# EAGLE board citizen_science_flora_v2_DFA_corrected (EAGLE 9.6.2)
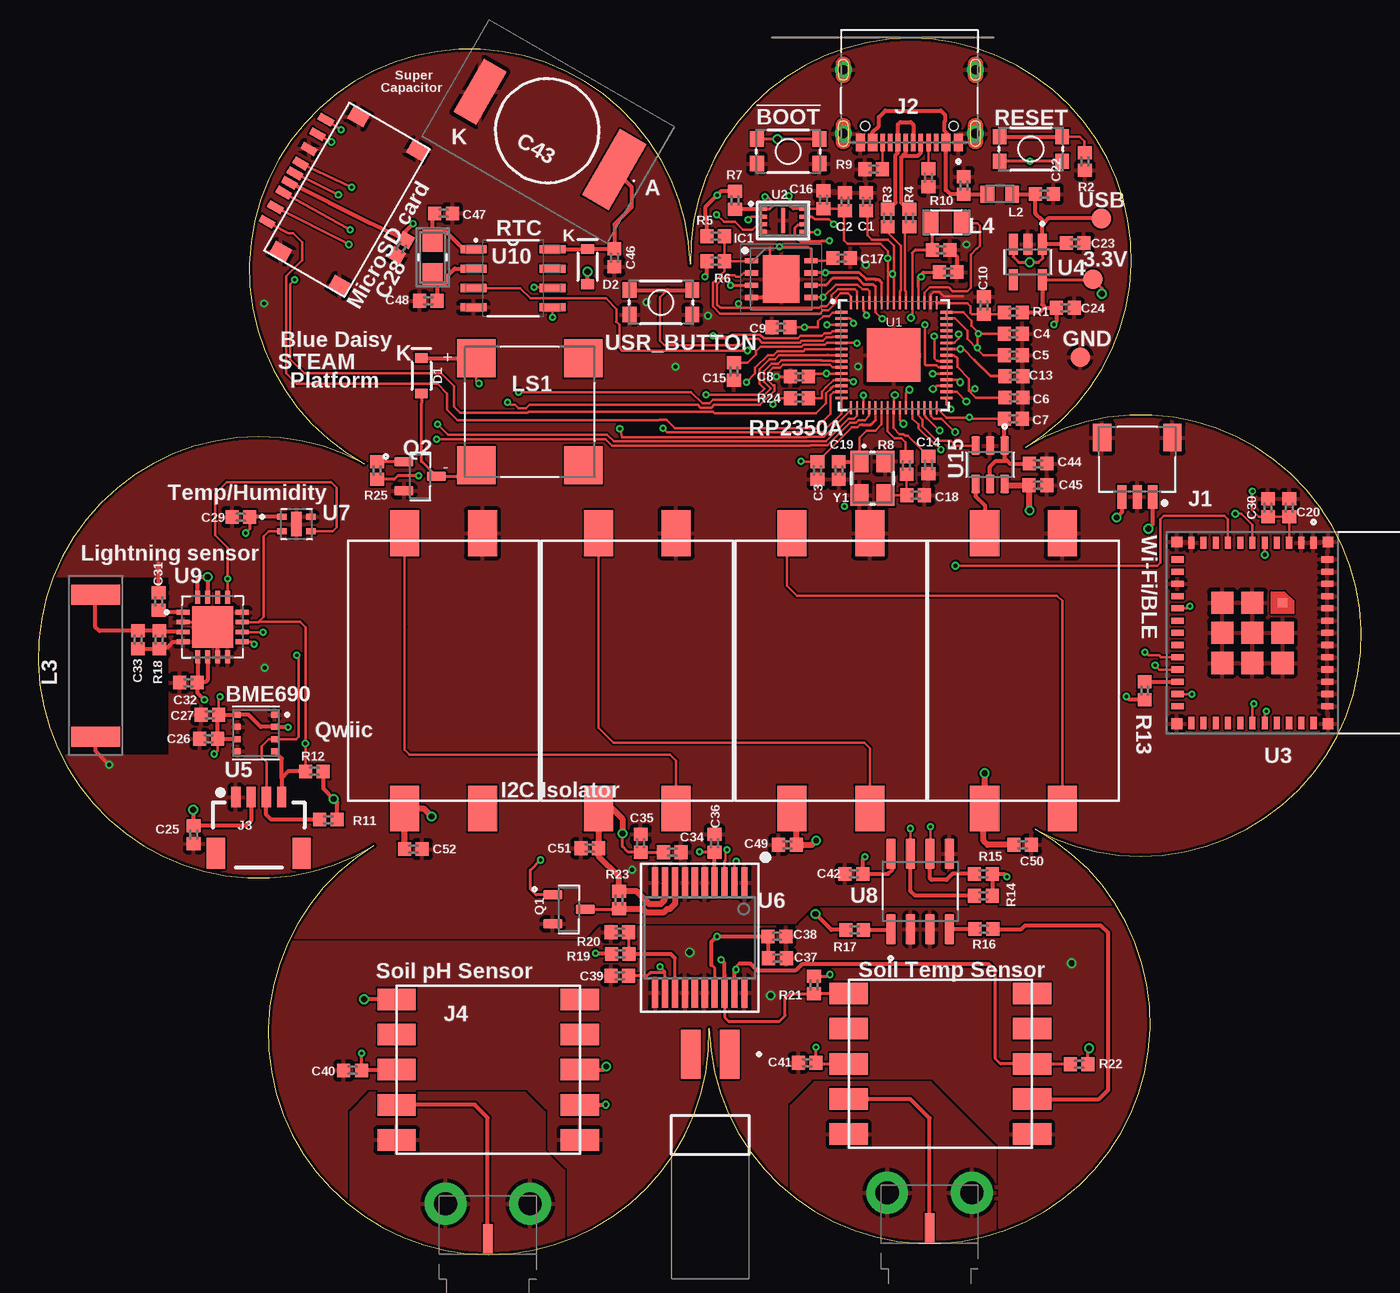
[diagram p4: board, top side]
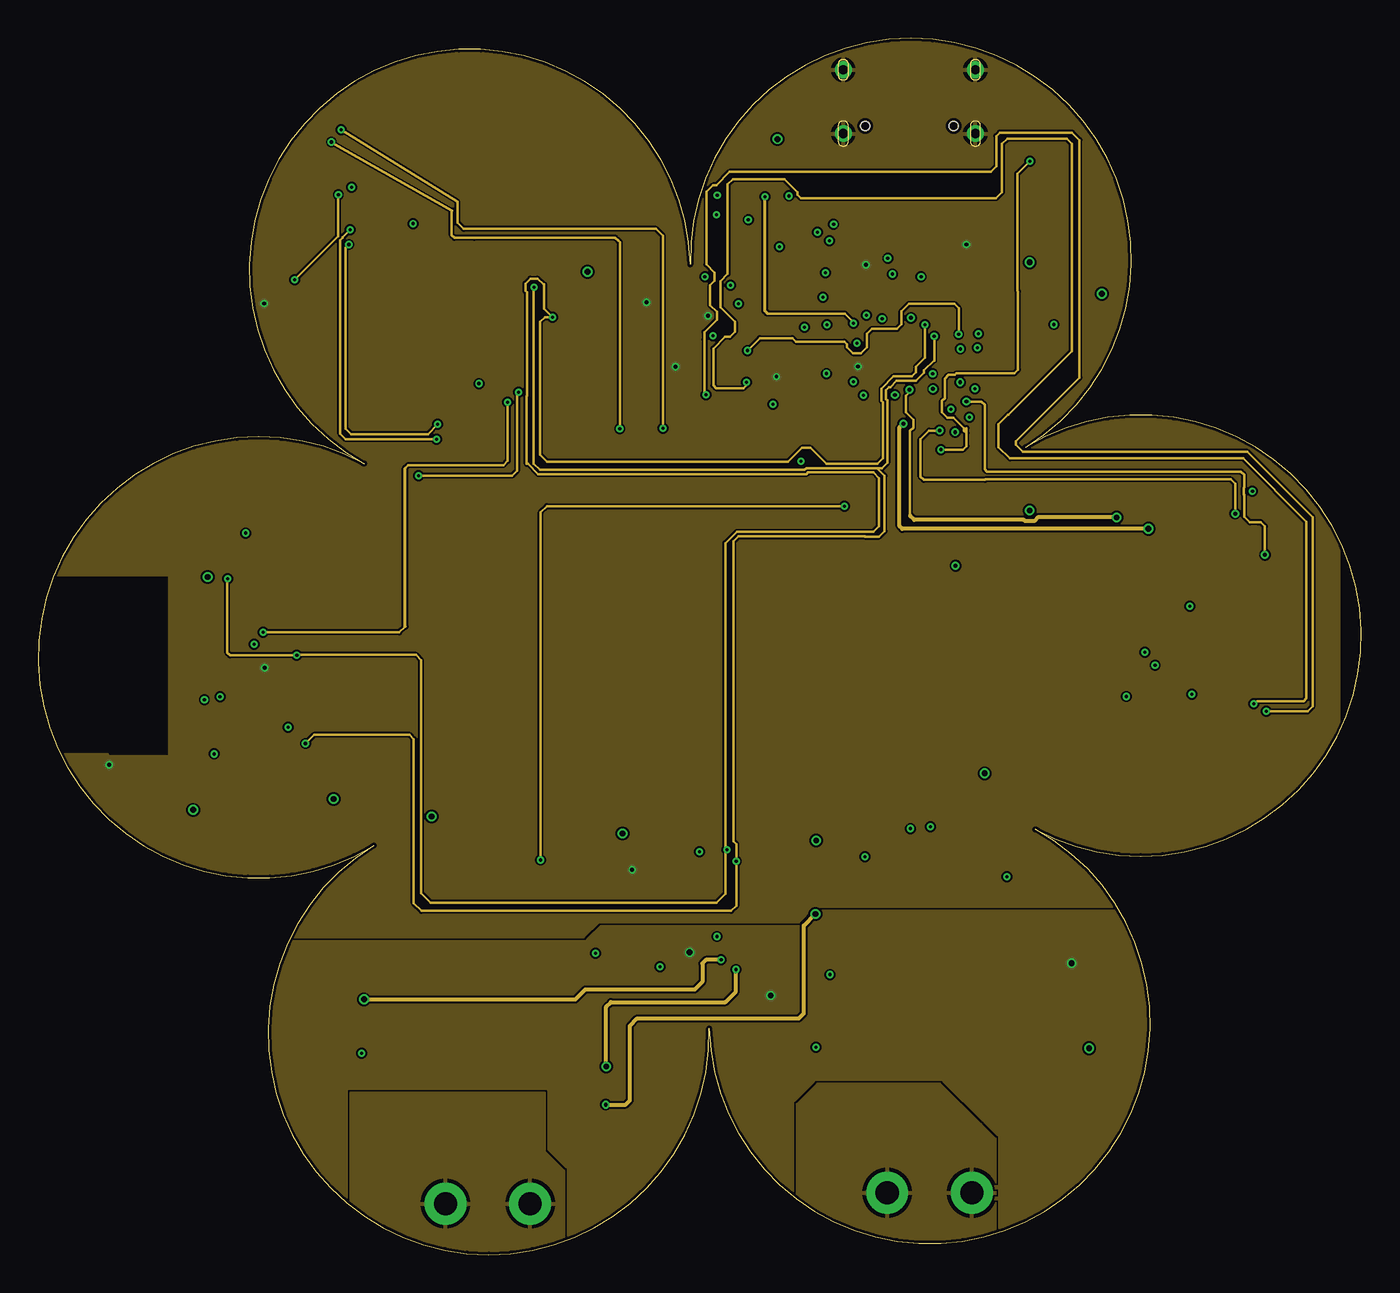
[diagram p5: board, inner layer Route2]
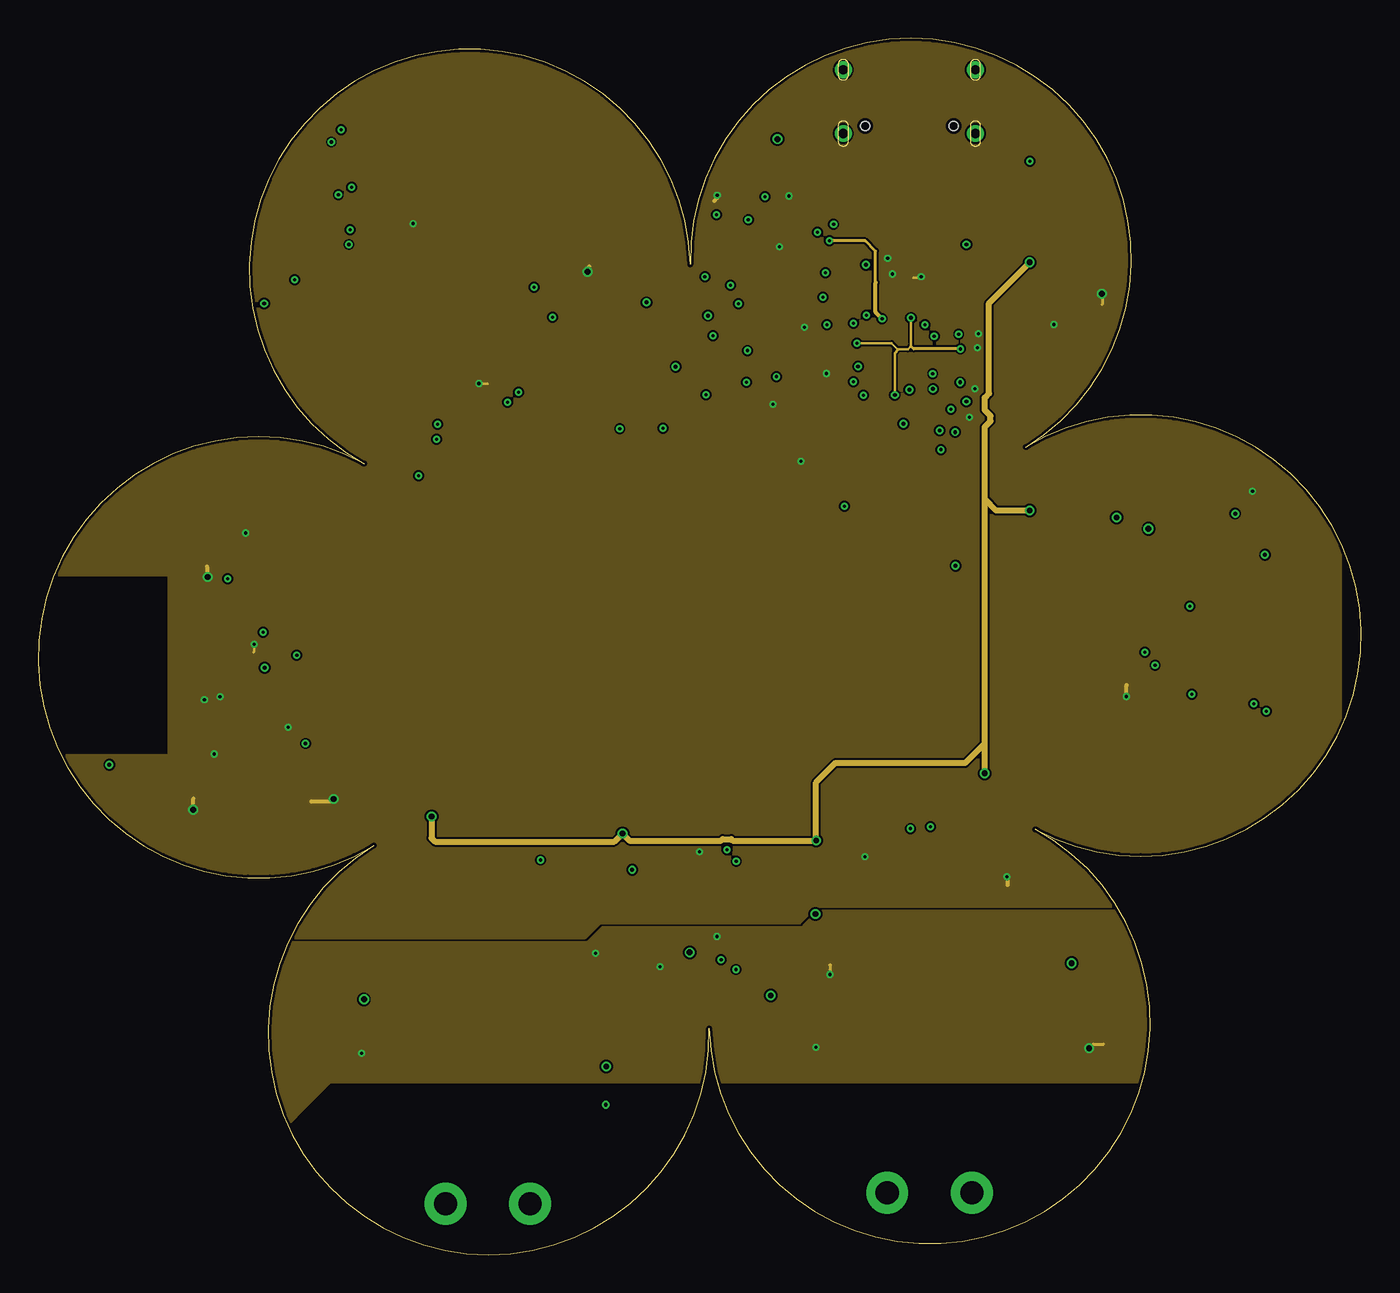
[diagram p6: board, inner layer Route15]
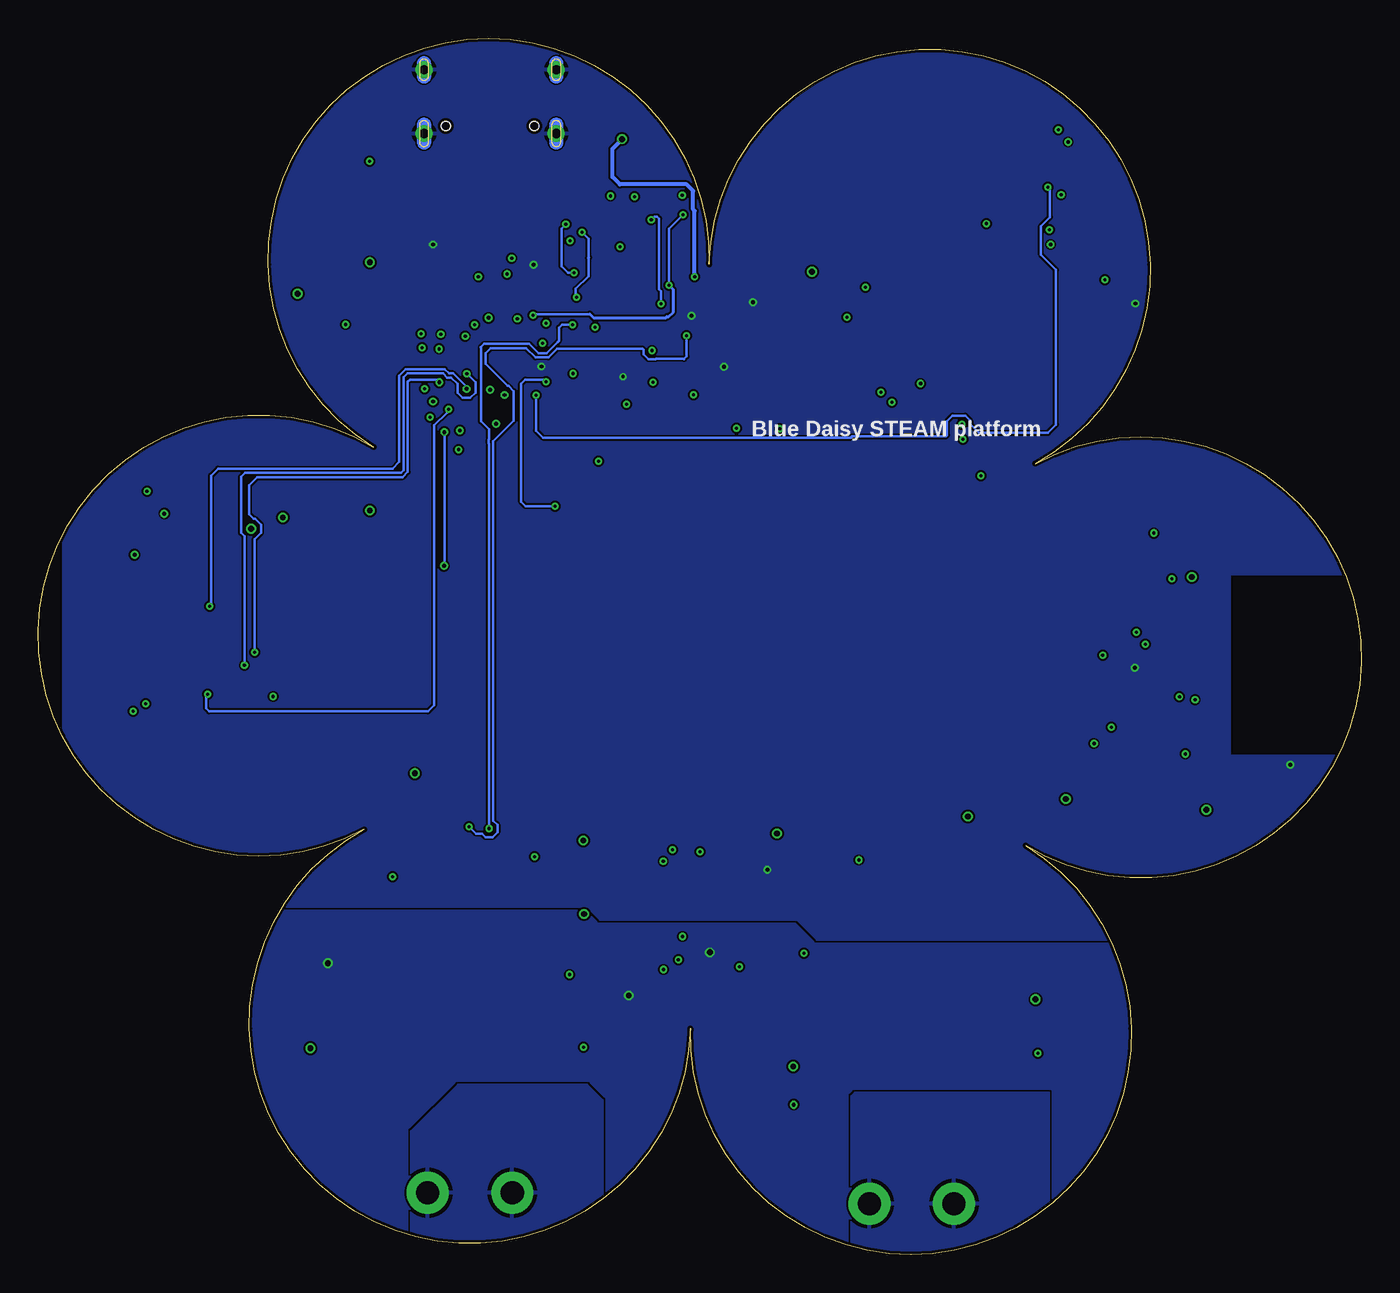
[diagram p7: board, bottom side, seen from below]

Size 86.58 x 79.57 mm. Coordinates in mm from the lower left corner, seen from the top.
Outline: 42.67,64.78 arc240 21.34,51.74 arc240 21.95,26.75 arc240 43.91,14.79 arc240 65.24,27.82 arc240 64.62,52.82 arc240 42.67,64.78
Copper layers (1+2*15+16): Top 0.035mm / dielectric 0.2mm / Route2 0.0175mm / dielectric 1.065mm / Route15 0.0175mm / dielectric 0.2mm / Bottom 0.035mm
Design rules "jlcpcb-4layers": minimum track width 3.5mil, minimum drill 0.2mm, track to track 5mil, track to pad 0.2mm, pad to pad 5mil, via to via 0.5mm, smd to smd 5mil, copper to edge 0.2mm, drill to drill 6mil, minimum pad ring 10mil, minimum via ring 0.13mm, stop-mask expansion 0.05mm, vias tented up to drill 16mil, thermal gap 10mil

## Footprints (pad centres in the part's own frame; a part is rotated, then mirrored left to right if it is on the bottom)
B1,27 = smd 1.27 x 1.27: TP 0,0
TACTILE_SWITCH_SMD_4.6X2.8MM = smd 0.9 x 1: 1 -2.05,-0.8; 2 2.05,-0.8; 3 2.05,0.8; 4 -2.05,0.8
0402 = smd 0.85 x 0.9: 1 -0.58,0; 2 0.58,0
RSCSK2043R3D01004T = smd 5 x 2: 1 0,5.075 | smd 4 x 1.7: 2 0,-5.075
SOD-323 = smd 0.63 x 0.83: A 1.15,0; C -1.15,0
SON80P400X400X50-9N = smd 0.85 x 0.35: 1 -1.95,1.2; 2 -1.95,0.4; 3 -1.95,-0.4; 4 -1.95,-1.2; 5 1.95,-1.2; 6 1.95,-0.4; 7 1.95,0.4; 8 1.95,1.2 | smd 2.4 x 3.1: 9 0,0
JST_SM03B-SRSS-TB(LF)(SN) = smd 0.6 x 1.55: 1 -1,0; 2 0,0; 3 1,0 | smd 1.2 x 1.8: S1 -2.3,-3.875; S2 2.3,-3.875
HRO_TYPE-C-31-M-12 = smd 0.6 x 1.14: A1_B12 -3.2,4.75; A4_B9 -2.4,4.75; B1_A12 3.2,4.75; B4_A9 2.4,4.75 | smd 0.3 x 1.14: A5 -1.25,4.75; A6 -0.25,4.75; A7 0.25,4.75; A8 1.25,4.75; B5 1.75,4.75; B6 0.75,4.75; B7 -0.75,4.75; B8 -1.75,4.75 | drill 0.6 pad 0.9: S1 -4.325,4.17; S2 4.325,4.17; S3 -4.325,0; S4 4.325,0 | hole 0.6: -2.89,3.68; 2.89,3.68
1X04_1MM_RA = smd 0.6 x 1.35: 1 -1.5,0; 2 -0.5,0; 3 0.5,0; 4 1.5,0 | smd 1.2 x 2: NC1 2.8,-3.675; NC2 -2.8,-3.675
60312202114511 = smd 0.61 x 1.97: 1 0,-2.325 | drill 1.52: 2 -2.77,0; 3 2.77,0
SAMTEC_TSM-102-02-S-SH = smd 1.27 x 3.18: 01 -1.27,-5.28; 02 1.27,-5.28
INDC1608X100N = smd 0.89 x 1.11: 1 -0.814,0; 2 0.814,0
MA5532-AE = smd 1.3 x 3.2: 1 -4.65,0; 2 4.65,0
IND_LQH2MCN120K02L = smd 1 x 1.6: 1 -1,0; 2 1,0
XDCR_CMT-8504-100-SMT-TR = smd 2.5 x 2.5: 1 3.5,3.5; 2 3.5,-3.5; N -3.5,-3.5; P -3.5,3.5
SOT95P240X111-3N = smd 1.23 x 0.6: 1 -1.06,0.95; 2 -1.06,-0.95; 3 1.06,0
RP2350A = smd 0.875 x 0.2: 1 -3.437,2.8; 2 -3.437,2.4; 3 -3.437,2; 4 -3.437,1.6; 5 -3.437,1.2; 6 -3.437,0.8; 7 -3.437,0.4; 8 -3.437,0; 9 -3.437,-0.4; 10 -3.437,-0.8; 11 -3.437,-1.2; 12 -3.437,-1.6; 13 -3.437,-2; 14 -3.437,-2.4; 15 -3.437,-2.8; 31 3.437,-2.8; 32 3.437,-2.4; 33 3.437,-2; 34 3.437,-1.6; 35 3.437,-1.2; 36 3.437,-0.8; 37 3.437,-0.4; 38 3.437,0; 39 3.437,0.4; 40 3.437,0.8; 41 3.437,1.2; 42 3.437,1.6; 43 3.437,2; 44 3.437,2.4; 45 3.437,2.8 | smd 0.2 x 0.875: 16 -2.8,-3.437; 17 -2.4,-3.437; 18 -2,-3.437; 19 -1.6,-3.437; 20 -1.2,-3.437; 21 -0.8,-3.437; 22 -0.4,-3.437; 23 0,-3.437; 24 0.4,-3.437; 25 0.8,-3.437; 26 1.2,-3.437; 27 1.6,-3.437; 28 2,-3.437; 29 2.4,-3.437; 30 2.8,-3.437; 46 2.8,3.437; 47 2.4,3.437; 48 2,3.437; 49 1.6,3.437; 50 1.2,3.437; 51 0.8,3.437; 52 0.4,3.437; 53 0,3.437; 54 -0.4,3.437; 55 -0.8,3.437; 56 -1.2,3.437; 57 -1.6,3.437; 58 -2,3.437; 59 -2.4,3.437; 60 -2.8,3.437 | smd 3.5 x 3.5: EPAD 0,0
APS6404L-3SQR-ZR = smd 0.4 x 0.25: 1 -1.25,0.75; 2 -1.25,0.25; 3 -1.25,-0.25; 4 -1.25,-0.75; 5 1.25,-0.75; 6 1.25,-0.25; 7 1.25,0.25; 8 1.25,0.75 | smd 0.2 x 1.6: 9 0,0
XCVR_ESP32-C3-MINI-1-N4 = smd 0.8 x 0.4: 1 -5.9,1.3; 2 -5.9,0.5; 3 -5.9,-0.3; 4 -5.9,-1.1; 5 -5.9,-1.9; 6 -5.9,-2.7; 7 -5.9,-3.5; 8 -5.9,-4.3; 9 -5.9,-5.1; 10 -5.9,-5.9; 11 -5.9,-6.7; 25 5.9,-6.7; 26 5.9,-5.9; 27 5.9,-5.1; 28 5.9,-4.3; 29 5.9,-3.5; 30 5.9,-2.7; 31 5.9,-1.9; 32 5.9,-1.1; 33 5.9,-0.3; 34 5.9,0.5; 35 5.9,1.3 | smd 0.4 x 0.8: 12 -4.8,-7.6; 13 -4,-7.6; 14 -3.2,-7.6; 15 -2.4,-7.6; 16 -1.6,-7.6; 17 -0.8,-7.6; 18 0,-7.6; 19 0.8,-7.6; 20 1.6,-7.6; 21 2.4,-7.6; 22 3.2,-7.6; 23 4,-7.6; 24 4.8,-7.6; 36 4.8,2.2; 37 4,2.2; 38 3.2,2.2; 39 2.4,2.2; 40 1.6,2.2; 41 0.8,2.2; 42 0,2.2; 43 -0.8,2.2; 44 -1.6,2.2; 45 -2.4,2.2; 46 -3.2,2.2; 47 -4,2.2; 48 -4.8,2.2 | smd 0.6 x 0.6: 49_1 -1.975,-0.725 | smd 1.45 x 1.45: 49_2 0,-0.725; 49_3 1.975,-0.725; 49_4 1.975,-2.7; 49_5 1.975,-4.675; 49_6 0,-4.675; 49_7 -1.975,-4.675; 49_8 -1.975,-2.7; 49_9 0,-2.7 | smd 0.7 x 0.7: 50 5.95,2.25; 51 5.95,-7.65; 52 -5.95,-7.65; 53 -5.95,2.25
SOT95P280X145-5N = smd 1.39 x 0.58: 1 -1.165,0.95; 2 -1.165,0; 3 -1.165,-0.95; 4 1.165,-0.95; 5 1.165,0.95
IC_BME688 = smd 0.4 x 0.4: 1 1.2,1.2; 2 1.2,0.4; 3 1.2,-0.4; 4 1.2,-1.2; 5 -1.2,-1.2; 6 -1.2,-0.4; 7 -1.2,0.4; 8 -1.2,1.2
SSOP20 = smd 0.4 x 2: P1 -2.925,-3.6; P2 -2.275,-3.6; P3 -1.625,-3.6; P4 -0.975,-3.6; P5 -0.325,-3.6; P6 0.325,-3.6; P7 0.975,-3.6; P8 1.625,-3.6; P9 2.275,-3.6; P10 2.925,-3.6; P11 2.925,3.6; P12 2.275,3.6; P13 1.625,3.6; P14 0.975,3.6; P15 0.325,3.6; P16 -0.325,3.6; P17 -0.975,3.6; P18 -1.625,3.6; P19 -2.275,3.6; P20 -2.925,3.6
XDCR_ENS210-LQFM = smd 0.6 x 0.4: 1 -0.95,0.475; 2 -0.95,-0.475; 3 0.95,-0.475; 4 0.95,0.475 | smd 0.7 x 1.6: 5 0,0
SOIC127P599X175-8N = smd 1.97 x 0.6: 1 -2.47,1.905; 2 -2.47,0.635; 3 -2.47,-0.635; 4 -2.47,-1.905; 5 2.47,-1.905; 6 2.47,-0.635; 7 2.47,0.635; 8 2.47,1.905
QFN65P400X400X80-17N = smd 0.84 x 0.32: 1 -1.935,0.975; 2 -1.935,0.325; 3 -1.935,-0.325; 4 -1.935,-0.975; 9 1.935,-0.975; 10 1.935,-0.325; 11 1.935,0.325; 12 1.935,0.975 | smd 0.32 x 0.84: 5 -0.975,-1.935; 6 -0.325,-1.935; 7 0.325,-1.935; 8 0.975,-1.935; 13 0.975,1.935; 14 0.325,1.935; 15 -0.325,1.935; 16 -0.975,1.935 | smd 2.7 x 2.7: 17 0,0
SOIC127P600X175-8N = smd 1.702 x 0.533: 1 -2.591,1.905; 2 -2.591,0.635; 3 -2.591,-0.635; 4 -2.591,-1.905; 5 2.591,-1.905; 6 2.591,-0.635; 7 2.591,0.635; 8 2.591,1.905
OPS-S56AAF5 = smd 1.9 x 3: P$1 -2.54,-9; P$2 2.54,-9; P$3 2.54,9; P$4 -2.54,9
SOT95P280X145-6N = smd 1.21 x 0.58: 1 -1.255,0.95; 2 -1.255,0; 3 -1.255,-0.95; 4 1.255,-0.95; 5 1.255,0; 6 1.255,0.95
MICROSDCARD = smd 0.5 x 1: G1 0.2,0; P1 3.85,0; P2 2.75,0; P3 1.65,0; P4 0.9,0; P5 -0.55,0; P6 -1.65,0; P7 -2.75,0; P8 -3.85,0 | smd 0.95 x 1.2: P$1 -5.1,1.75; P$2 -5.1,6.2; P$3 5.1,6.2; P$4 5.1,1.75
PH_SENSOR = smd 2.5 x 1.4: P$1 -6,4.6; P$2 -6,2.3; P$3 -6,0; P$4 -6,-2.3; P$5 -6,-4.6; P$6 6,-4.6; P$7 6,-2.3; P$8 6,0; P$9 6,2.3; P$10 6,4.6
XTAL_FC-135_EPS = smd 1.422 x 1.295: 1 -1.092,0; 2 1.092,0
CRYSTAL-SMD-3.2X2.5MM = smd 1.4 x 1.2: 1 -1.1,-0.85; 2 1.1,-0.85; 3 1.1,0.85; 4 -1.1,0.85

## Placement (x,y rotation side)
3.3V  TPB1,27  [B1,27]  69.02,63.81 0 top
!BOOT  MOMENTARY-SWITCH-SPST-SMD-4.6X2.8MM  [TACTILE_SWITCH_SMD_4.6X2.8MM]  49.08,72.17 0 top
C1  0.1uF  [0402]  54.18,68.87 90 top
C2  0.1uF  [0402]  52.79,68.87 90 top
C3  0.1uF  [0402]  50.98,51.29 270 top
C4  0.1uF  [0402]  63.81,60.23 0 top
C5  0.1uF  [0402]  63.81,58.83 0 top
C6  0.1uF  [0402]  63.84,56.06 0 top
C7  0.1uF  [0402]  63.81,54.67 0 top
C8  0.1uF  [0402]  49.82,57.44 180 top
C9  0.1uF  [0402]  48.6,60.66 180 top
C10  4.7UF0402  [0402]  61.88,62.08 90 top
C11  4.7UF0402  [0402]  59.09,65.72 0 top
C12  4.7UF0402  [0402]  59.54,64.27 0 top
C13  0.1uF  [0402]  63.84,57.46 0 top
C14  4.7UF0402  [0402]  58.25,51.64 270 top
C15  0.1uF  [0402]  45.52,57.77 270 top
C16  0.1uF  [0402]  51.39,68.99 90 top
C17  0.1uF  [0402]  52.58,65.18 180 top
C18  15pF  [0402]  57.41,49.66 0 top
C19  15pF  [0402]  52.38,51.29 270 top
C20  10UF0402  [0402]  81.87,48.85 90 top
C21  0.1uF  [0402]  60.56,69.93 90 top
C22  0.1uF  [0402]  65.84,69.37 0 top
C23  10UF0402  [0402]  67.85,66.17 180 top
C24  10UF0402  [0402]  67.21,61.93 180 top
C25  0.1uF  [0402]  10.17,27.46 270 top
C26  0.1uF  [0402]  11.16,33.74 180 top
C27  0.1uF  [0402]  11.23,35.31 180 top
C28  0.1uF  [0402]  23.76,65.87 240 top
C29  0.1uF  [0402]  13.27,48.24 180 top
C30  0.1uF  [0402]  80.47,48.85 90 top
C31  10UF0402  [0402]  7.88,42.73 90 top
C32  1.0uF  [0402]  9.84,37.42 180 top
C33  1nF  [0402]  6.53,40.21 270 top
C34  0.1uF  [0402]  41.48,26.32 180 top
C35  10UF0402  [0402]  39.43,26.91 270 top
C36  0.1uF  [0402]  44.25,26.91 270 top
C37  10UF0402  [0402]  48.37,19.39 0 top
C38  0.1uF  [0402]  48.34,20.81 0 top
C39  0.1uF  [0402]  38.06,18.24 180 top
C40  0.1uF  [0402]  20.58,12.05 0 top
C41  0.1uF  [0402]  50.32,12.55 0 top
C42  0.1uF  [0402]  53.37,24.9 0 top
C43  RSCSK2043R3D01004T  [RSCSK2043R3D01004T]  33.31,73.51 240 top
C44  0.1uF  [0402]  65.44,51.75 180 top
C45  0.1uF  [0402]  65.41,50.32 0 top
C46  0.1uF  [0402]  37.7,65.21 270 top
C47  12pF  [0402]  26.52,68.1 180 top
C48  12pF  [0402]  25.53,62.39 0 top
C49  0.1uF  [0402]  49.03,26.8 180 top
C50  0.1uF  [0402]  64.42,26.8 0 top
C51  0.1uF  [0402]  36.1,26.58 180 top
C52  0.1uF  [0402]  24.54,26.52 0 top
D1  1N4148  [SOD-323]  25.08,57.49 270 top
D2  1N5819  [SOD-323]  35.95,64.62 270 top
GND  TPB1,27  [B1,27]  68.18,58.71 0 top
IC1  W25Q64JVXGIQ  [SON80P400X400X50-9N]  48.62,63.81 0 top
J1  SM03B-SRSS-TB(LF)(SN)  [JST_SM03B-SRSS-TB(LF)(SN)]  71.91,49.56 180 top
J2  TYPE-C-31-M-12  [HRO_TYPE-C-31-M-12]  57,77.5 180 top
J3  [1X04_1MM_RA]  14.43,29.93 0 top
J4  60312202114511  [60312202114511]  29.42,3.33 0 top
J5  60312202114511  [60312202114511]  58.32,4.05 0 top
J6  TSM-102-02-S-SH  [SAMTEC_TSM-102-02-S-SH]  43.97,7.83 180 top
L2  LQW18AN2N2D10D  [INDC1608X100N]  62.92,69.37 0 top
L3  MA5532-AE  [MA5532-AE]  3.77,38.51 90 top
L4  3.3uH  [IND_LQH2MCN120K02L]  59.42,67.52 180 top
LS1  MLT-8530  [XDCR_CMT-8504-100-SMT-TR]  32.16,55.12 0 top
Q1  BSS138  [SOT95P240X111-3N]  34.73,22.59 0 top
Q2  BSS138  [SOT95P240X111-3N]  25,50.91 0 top
R1  33  [0402]  63.81,61.63 180 top
R2  1K  [0402]  68.48,71.51 270 top
R3  27  [0402]  55.58,67.8 270 top
R4  27  [0402]  57,67.8 270 top
R5  [0402]  44.33,66.61 180 top
R6  1K  [0402]  44.33,64.98 0 top
R7  10k  [0402]  45.6,68.97 270 top
R8  1K  [0402]  56.83,51.62 90 top
R9  5.1k  [0402]  54.67,71 0 top
R10  5.1k  [0402]  58.25,70.44 90 top
R11  DNF  [0402]  18.98,28.45 0 top
R12  2.2K  [0402]  18.07,31.6 0 top
R13  10k  [0402]  72.4,36.89 270 top
R14  1K  [0402]  61.86,23.48 0 top
R15  1K  [0402]  61.86,24.9 0 top
R16  100OHM  [0402]  61.88,21.29 180 top
R17  100OHM  [0402]  53.42,21.24 0 top
R18  10k  [0402]  7.93,40.21 90 top
R19  16.9K  [0402]  38.08,19.67 180 top
R20  10k  [0402]  38.06,21.09 0 top
R21  2.2K  [0402]  50.76,17.63 90 top
R22  2.2K  [0402]  68.1,12.45 0 top
R23  1M  [0402]  38,23.2 90 top
R24  1M  [0402]  49.82,56.01 180 top
R25  470  [0402]  22.18,51.29 270 top
RESET  MOMENTARY-SWITCH-SPST-SMD-4.6X2.8MM  [TACTILE_SWITCH_SMD_4.6X2.8MM]  64.95,72.32 0 top
U1  RP2350A  [RP2350A]  55.99,58.83 0 top
U2  APS6404L-3SQR-ZR  [APS6404L-3SQR-ZR]  48.75,67.65 0 top
U3  ESP32-C3-MINI-1-N4  [XCVR_ESP32-C3-MINI-1-N4]  82.15,40.67 270 top
U4  MIC5504-3.3YM5-T5  [SOT95P280X145-5N]  64.75,64.93 270 top
U5  BME690  [IC_BME688]  14.26,34.12 0 top
U6  ADM3260ARSZ  [SSOP20]  43.29,20.73 180 top
U7  ENS210-LQFM  [XDCR_ENS210-LQFM]  16.9,47.78 0 top
U8  SFH6325-X017TEL0631  [SOIC127P599X175-8N]  57.72,23.76 90 top
U9  AS3935-BQFT  [QFN65P400X400X80-17N]  11.41,41.05 0 top
U10  PCF8563T/F4,118  [SOIC127P600X175-8N]  31.07,63.86 0 top
U11  OPS-S56AAF5  [OPS-S56AAF5]  64.47,38.18 0 top
U12  OPS-S56AAF5  [OPS-S56AAF5]  51.87,38.18 0 top
U13  OPS-S56AAF5  [OPS-S56AAF5]  39.2,38.18 0 top
U14  OPS-S56AAF5  [OPS-S56AAF5]  26.52,38.18 0 top
U15  SN74LVC1T45DBVRG4  [SOT95P280X145-6N]  62.29,51.67 270 top
U$1  TF-123-ARP9HXX  [MICROSDCARD]  16.9,70.9 240 top
U$2  PH-OEM  [PH_SENSOR]  29.45,12.1 0 top
U$3  PH-OEM  [PH_SENSOR]  59.04,12.48 0 top
USB  V_USB  [B1,27]  69.55,67.77 0 top
USR_BUTTON  MOMENTARY-SWITCH-SPST-SMD-4.6X2.8MM  [TACTILE_SWITCH_SMD_4.6X2.8MM]  40.75,62.29 180 top
XTAL1  Q13FC1350000400  [XTAL_FC-135_EPS]  25.81,65.23 90 top
Y1  12MHz  [CRYSTAL-SMD-3.2X2.5MM]  54.59,50.78 270 top

## Tracks (layer width: path | path; a pad name or v marks a point on that pad's centre or on a via)
1.1V  (via drill 0.2, 0.25)
  Top 0.152: U1.39 59.8,59.24 | v56.05,56.23 55.99,56.17 U1.23 55.96,55.37 55.96,54.87 55.96,54.08 56.37,53.68 56.61,53.68 56.74,53.55 56.92,53.55 C14.1 | U1.39 59.8,59.23 | 59.8,59.23 59.99,59.23 | C13.1 62.94,57.46 | v53.58,59.62 53.56,59.63 U1.6 51.61,59.63 51.47,59.5 50.07,59.5 49.95,59.38 47.26,59.38 46.97,59.09 46.97,58.91 46.42,58.35 C15.1 | v57.11,61.27 57.19,61.35 U1.50 57.19,65.52 | 61.27,58.52 60.55,59.24 59.8,59.24 | 59.8,59.23 59.8,59.24 | v60.36,59.24 v60.35,59.23 U1.39
  Top 0.203: C13.1 62.33,57.46 61.27,58.52 | 57.19,65.52 57.39,65.72 C11.1 58.51,67.43 L4.2
  Top 0.254: 58.44,67.55 L4.2 | 58.28,67.39 L4.2 | L4.2 58.42,66.93
  Route15 0.152: 56.27,59.19 56.05,58.97 v56.05,56.23 | 56.27,59.19 56.29,59.21 56.9,59.21 57.11,59.42 v57.11,61.27 | v53.58,59.62 55.84,59.62 56.27,59.19
  Route15 0.203: v60.36,59.24 57.28,59.24 57.11,59.42
3.3V  (via drill 0.2, 0.38)
  Top 0.152: 63.24,54.74 C7.1 61.05,54.67 v60.94,54.78 | 63.38,56.01 C6.1 61.35,56.06 60.92,56.5 | U1.11 v51.57,57.63 50.59,57.63 C8.1 | U1.20 54.79,54.59 | U1.30 59.44,54.74 60.9,54.74 | U1.38 59.93,58.83 60.14,58.62 60.14,58.07 60.92,57.3 60.92,56.5 | U9.9 13.97,40.08 v14.13,39.92 | LS1.P 28.66,57.15 v28.84,56.98 | U1.1 52.53,61.61 51.97,61.61 51.75,61.4 51.37,61.4 51.04,61.07 51.04,60.68 51.02,60.66 v50.15,60.66 C9.1 | U1.49 57.59,63.28 | U1.53 55.99,63.91 | 55.99,63.91 55.99,66 55.61,66.38 54.57,66.38 54.26,66.68 54.26,68.29 | U1.54 v55.59,65.18 55.59,65.63 55.1,66.12 52.97,66.12 52.74,66.35 52.74,68.24 C2.1 52.66,68.41 C16.1 | 51.39,68.4 U2.8 | 55.99,63.91 55.89,64.02 v55.89,64.14 | 57.59,63.96 v57.78,63.96 | C4.1 61.6,60.23 61.07,60.76 61.07,61.09 60.53,61.63 U1.45 U1.44 60,61.23 60.79,60.44 60.79,59.9 61.46,59.23 | C5.1 61.86,58.83 61.46,59.23 | 61.46,59.23 61.46,60.17 v61.52,60.23 | 60.92,56.5 61.17,56.5 v61.31,56.63 | 54.49,54.29 53.77,54.29 53.61,54.12 53.24,54.12 C3.1 49.95,51.87 v49.92,51.9 | C17.2 51.83,65.01 IC1.8 | v48.5,65.92 50.38,65.92 50.57,65.72 | R24.2 48.47,56.01 v48.09,55.63 | C20.1 81.74,48.27 | 81.74,48.27 C30.1 79.86,48.27 79.41,48.72 79.41,49.89 v79.46,49.94 | U3.3 81.85,48.16 81.74,48.27 | C26.1 11.74,32.97 v11.51,32.75 | C27.1 11.81,36.4 v11.89,36.48
  Top 0.203: 54.26,68.29 C1.1 | U4.5 68.97,63.76 3.3V.TP 69.6,63.23 v69.6,62.85 | 51.39,68.4 C16.1 | 54.79,54.59 54.49,54.29 53.91,54.29 | 57.59,63.28 57.59,63.96 57.89,64.27 C12.1 | C29.1 13.85,47.48 v13.57,47.2 | v60.94,54.78 60.9,54.74 | C36.2 43.28,26.33 v43.26,26.35 | 50.57,65.72 IC1.8 | U2.8 49.4,68.4 49.22,68.57 | 49.22,68.57 49.13,68.66 | 49.22,68.57 49.22,69.16 v49.13,69.25
  Top 0.254: R13.2 71.4,36.31 v71.2,36.51 | U8.8 55.89,26.15 55.89,25.18 55.61,24.9 C42.2 53.95,25.86 v54.11,26.02 | R14.2 R15.2 63.2,24.9 v63.38,24.72 | U7.1 13.78,48.26 C29.1 | U9.16 10.44,44.24 10.52,44.33 v11.08,44.33 v11.09,44.32 U9.15 | 10.44,38.81 U9.5 10.44,37.44 | 10.44,37.44 C32.1 10.42,36.77 v10.88,36.3 | U9.6 11.09,37.58 10.95,37.44 10.44,37.44 | U5.6 13.04,33.74 C26.1 11.74,35.24 C27.1 U5.8 13.77,35.32 14.57,34.52 U5.2 16.35,34.52 v16.36,34.5 | J3.2 13.93,28.39 13.59,28.04 10.35,28.04 10.17,28.23 | C25.1 10.17,28.23 | 10.17,28.23 10.17,29.06 v10.14,29.09 | D1.C 29.12,58.64 29.32,58.83 28.87,58.83 LS1.P | U$1.P4 21.6,67.52 C28.1 24.05,66.95 v24.54,67.44 | U15.5 62.29,51.54 62.67,51.92 63.41,51.92 | 63.41,51.92 63.24,52.09 U15.1 C7.1 | 63.41,51.92 63.58,51.75 C44.2 | C30.1 | R7.1 44.68,69.55 v44.43,69.3 43.68,68.55 43.68,67.74 43.75,67.67 R5.2 | R11.2 19.56,29.58 v19.34,29.8 18.65,30.49 R12.2 | D2.A v35.95,64.29 | R1.1 65.54,61.63 65.84,61.93 65.92,61.93 | 65.92,61.93 C24.2 66.64,61.02 v66.45,60.84 | U4.5 65.7,62.15 65.92,61.93 | U6.P4 C36.2
  Route15 0.152: v14.13,39.92 14.13,39.43 14.1,39.4 | v28.84,56.98 29.39,56.98 29.42,56.95 | v57.78,63.96 57.73,63.91 57.26,63.91
  Route15 0.203: v69.6,62.85 69.63,62.82 69.63,62.16
  Route15 0.254: v71.2,36.51 71.2,37.22 71.23,37.24 | v11.09,44.32 11.09,44.96 11.03,45.02 | v10.14,29.09 10.14,29.83 | v44.43,69.3 44.43,69.12 44.23,68.92 | v19.34,29.8 19.16,29.62 17.89,29.62 | v35.95,64.29 35.95,64.52 36.05,64.62 | v63.38,24.72 63.43,24.67 63.43,24.16
  other vias: 61.45,59.32
  pour Route15: 1.38,20.73 1.38,32.59 1.43,32.65 8.62,32.65 8.62,34.32 8.62,44.48 7.98,44.48 -3.22,44.48 -3.22,80.32 90.28,80.32 90.28,78.9 90.28,47.35 85.17,47.35 85.17,22.79 83.22,22.79 50.88,22.79 49.79,21.7 49.33,21.7 36.94,21.7 36.91,21.72 36.73,21.72 35.74,20.73 1.43,20.73
!ESP32_BOOT  (via drill 0.2)
  Top 0.152: v75.5,36.66 74.56,36.66 U3.23 | v59.72,55.31 59.43,55.6 U1.31
  Bottom 0.152: v75.5,36.66 75.6,36.56 75.6,35.74 75.39,35.54 61.07,35.54 60.69,35.92 60.69,54.24 60.66,54.24 59.84,55.06 59.72,55.18 v59.72,55.31
!ESP32_RST  (via drill 0.25)
  Top 0.152: v60,53.8 59.98,53.8 59.1,54.68 58.6,54.68 58.41,54.87 58.41,55.37 U1.29 | v60.03,45.07 73.24,45.07 73.44,45.27 73.44,48.11 73.67,48.34 77.62,48.34 77.85,48.11 U3.8
  Bottom 0.152: v60,53.8 60,45.09 v60.03,45.07
!FLASH_CS  (via drill 0.2)
  Top 0.152: U1.2 53.11,61.23 53.35,60.99 v53.35,60.93
  Top 0.203: U2.1 47.87,68.4 48.11,68.64 48.11,68.82 47.73,69.2 v47.56,69.2
  Top 0.254: R7.2 U2.1
  Route2 0.152: 47.68,61.6 47.73,61.55 52.79,61.55 53.35,60.99 v53.35,60.93
  Route2 0.203: v47.56,69.2 47.56,61.73 47.68,61.6
!QSPI_CS
  Top 0.152: U1.60 53.19,62.67 52.99,62.87 52.51,62.87 52.2,62.56 52.2,62.26 51.71,61.77 51.35,61.77 51.13,61.55 44.62,61.55 44.15,62.02 44.15,63.58 44.91,64.34 R6.2 | R6.2 46.64,64.98 IC1.1 | R6.2 R5.1
!RESET  (via drill 0.2)
  Top 0.152: U1.26 57.21,55.38 57.21,54.68 57.58,54.3 57.58,54.06 57.61,54.06 58.74,52.93 58.81,52.93 58.98,52.76 58.98,52.75 v59.06,52.66
  Top 0.203: RESET.2 v64.88,71.52 RESET.1
  Route2 0.152: v64.88,71.52 64.07,70.71 64.07,63.05 64.12,63 64.12,57.89 63.86,57.64 60.09,57.64 59.98,57.54 59.57,57.54 59.32,57.28 59.32,56.03 59.14,55.85 59.14,55.1 59.49,54.74 59.89,54.74 60.59,54.05 60.59,53.9 60.74,53.75 | v59.06,52.66 60.51,52.66 60.74,52.89 60.74,53.75 | 60.74,53.75 60.74,54.06
!USB_BOOT  (via drill 0.2, 0.38)
  Top 0.203: !BOOT.3 v48.37,72.97 !BOOT.4 | v43.62,63.96 43.75,64.1
  Top 0.254: 43.75,64.1 R6.1
  Bottom 0.254: v43.62,63.96 43.62,68.26 43.73,68.37 43.73,69.59 44.14,70 48.51,70 49,70.49 49,72.33 v48.37,72.97
BUZZER_DRIVER  (via drill 0.2)
  Top 0.152: v24.89,50.96 v24.9,50.96 | v31.43,56.42 42.72,56.42 43.46,55.68 43.93,55.68 44.16,55.91 47.18,55.91 47.9,56.63 47.9,56.66 47.48,57.09 47.48,57.78 47.97,58.28 48.42,58.28 48.63,58.5 51.24,58.5 51.26,58.47 51.92,58.47 51.96,58.43 U1.9
  Top 0.203: v24.89,50.96 v24.9,50.96 23.53,50.96 23.27,50.71 R25.2
  Route2 0.152: v31.43,56.42 31.33,56.32 31.33,51.26 31.02,50.96 v24.9,50.96
CMD  (via drill 0.2)
  Top 0.152: U1.19 54.36,55.37 54.36,54.87 54.09,54.59 53.68,54.59 53.5,54.4 53.12,54.4 51.66,52.94 50.53,52.94 50.5,52.92 37.55,52.92 37.12,53.35 v26.07,53.35 | U$1.P3 v20.4,67.04
  Route2 0.152: v26.07,53.35 20.12,53.35 19.77,53.7 19.77,66.36 19.92,66.51 19.92,66.56 v20.4,67.04
DAT0  (via drill 0.2)
  Top 0.152: v38.06,54.01 38.21,53.47 50.27,53.47 50.3,53.5 51.43,53.5 53.19,55.26 U1.16 | U$1.P7 v19.18,72.78
  Route2 0.152: 27.07,68.27 27.06,68.26 27.06,66.68 27.24,66.5 28.53,66.5 28.56,66.53 37.75,66.53 37.97,66.31 38.06,66.22 v38.06,54.01 | 27.07,68.27 27.08,68.28 | v19.18,72.78 27.07,68.27
DAT1  (via drill 0.2)
  Top 0.152: v40.88,54.06 41.15,53.78 51.31,53.78 52.55,55.02 U1.15 | U$1.P8 v19.82,73.59
  Route2 0.152: v40.88,54.06 40.88,66.63 40.42,67.09 27.85,67.09 27.44,67.49 27.44,68.87 v19.82,73.59
DAT2
  Top 0.152: U1.14 52.53,56.41 52.02,56.41 51.84,56.22 51.84,54.99 50.91,54.06 41.67,54.06 41.15,54.58 41.11,54.62 40.64,54.62 40.6,54.58 27.45,54.58 26.75,55.28 26.75,56.32 26.12,56.95 16.92,56.95 16.21,57.67 16.21,63.99 17.28,65.06 17.28,66.22 16.69,66.81 16.36,66.81 U$1.P1
DAT3  (via drill 0.2)
  Top 0.152: U1.17 53.56,55.37 53.56,54.87 53.38,54.68 53.01,54.68 51.54,53.22 50.41,53.22 50.39,53.19 37.66,53.19 37.23,53.63 26.83,53.63 v26.14,54.31 | U$1.P2 v20.33,66.07
  Route2 0.152: v26.14,54.31 25.51,53.68 20.48,53.68 20.12,54.03 20.12,65.87 v20.33,66.07
ESP32_CS  (via drill 0.2, 0.25)
  Top 0.152: v58.55,56.63 58.76,56.83 U1.33 | U3.16 75.24,42.27 v75.37,42.4
  Bottom 0.152: 75.27,42.32 75.27,42.35 | 75.27,42.35 75.27,50.96 74.81,51.42 63.38,51.42 62.95,51.85 62.95,57.5 62.53,57.92 59.97,57.92 59.69,57.64 59.44,57.64 58.55,56.76 v58.55,56.63 | v75.37,42.4 75.32,42.4 75.27,42.35
ESP32_HANDSHAKE  (via drill 0.25)
  Top 0.152: U3.6 79.45,47.74 78.72,48.47 v78.32,48.47 | U1.28 57.99,54.89 58.17,54.72 58.17,54.71 58.96,53.91 v58.99,53.91
  Route2 0.152: v78.32,48.47 78.32,50.42 78.04,50.71 61.98,50.71 61.96,50.68 57.94,50.68 57.74,50.88 57.74,53.35 58.3,53.91 v58.99,53.91
ESP32_MISO  (via drill 0.25)
  Top 0.152: U3.5 80.25,45.8 v80.27,45.78 | U1.32 60.1,56.43 v60.74,55.8
  Route2 0.152: v80.27,45.78 80.27,47.63 79.99,47.91 79.84,47.91 79.83,47.9 79.29,47.9 78.91,48.28 78.91,49.7 78.9,49.71 78.9,50.18 78.91,50.19 78.91,51 78.7,51.21 62.08,51.21 61.93,51.37 61.93,55.58 61.71,55.8 v60.74,55.8
ESP32_MOSI  (via drill 0.2)
  Top 0.152: U3.21 73.35,38.27 v73.08,38.54 | U1.35 58.55,57.63 v58.53,57.61
  Bottom 0.152: v73.08,38.54 73.08,46.99 73.3,47.21 73.3,50.87 73.03,51.14 62.85,51.14 62.67,51.32 62.67,57.39 62.41,57.64 60.09,57.64 59.81,57.36 59.55,57.36 59.14,56.95 59.14,56.38 58.8,56.04 58.31,56.04 57.97,56.38 57.97,57.05 v58.53,57.61
ESP32_RX  (via drill 0.2)
  Top 0.152: U1.7 51.6,59.23 51.59,59.22 50.19,59.22 50.06,59.1 48.37,59.1 48.11,58.84 47.74,58.84 46.92,58.02 46.92,57.65 46.34,57.07 v46.34,57.06 | U3.30 79.45,35.96 v79.54,36.04
  Route2 0.152: v79.54,36.04 79.67,36.17 79.74,36.17 79.77,36.2 82.81,36.2 82.99,36.38 82.99,47.94 78.85,52.08 63.58,52.08 62.85,52.81 62.85,54.32 63.47,54.94 67.62,59.09 67.62,72.68 67.32,72.98 63.41,72.98 63.08,72.65 63.08,69.5 62.68,69.1 49.91,69.1 49.69,69.32 49.69,69.48 48.83,70.34 45.45,70.34 45.12,70.01 45.12,64.15 44.64,63.68 44.64,62.73 44.63,62.72 44.63,61.96 45.58,61.01 45.58,60.36 45.25,60.03 44.95,60.03 44.18,59.27 44.18,56.85 44.36,56.67 46.16,56.67 46.34,56.85 v46.34,57.06
ESP32_SCK  (via drill 0.2, 0.25)
  Top 0.152: U3.20 73.47,39.07 73.35,39.19 72.64,39.19 v72.42,39.4 | v60.33,57.05 60.15,57.23 U1.34
  Bottom 0.152: v72.42,39.4 72.42,46.79 72,47.21 72,47.75 72.38,48.13 72.46,48.13 72.78,48.44 72.78,50.32 72.24,50.86 62.73,50.86 62.39,51.2 62.39,57.08 62.24,57.23 60.51,57.23 v60.33,57.05
ESP32_TX  (via drill 0.2)
  Top 0.152: U1.8 51.67,58.83 | 51.65,58.86 51.67,58.83 | U3.31 80.25,35.42 v80.37,35.54 | 51.67,58.83 50.19,58.83 50.18,58.82 48.48,58.82 48.22,58.56 47.85,58.56 47.2,57.9 47.2,56.97 47.52,56.65 47.11,56.24 v43.69,56.24
  Route2 0.152: v80.37,35.54 83.06,35.54 83.4,35.87 83.4,48.22 79.1,52.51 64.45,52.51 63.99,52.97 63.99,53.22 68.13,57.36 68.13,72.91 67.65,73.39 62.92,73.39 62.69,73.16 62.69,71.18 62.34,70.82 45.24,70.82 44.37,69.95 44.16,69.95 43.73,69.52 43.73,64.77 44.27,64.23 44.27,63.69 43.97,63.4 43.97,62.1 44.41,61.67 44.41,61.16 43.59,60.34 43.59,59.87 43.59,59.86 43.59,56.34 v43.69,56.24
GND  (via drill 0.2, 0.25)
  Top 0.152: 49.27,57.39 C8.2 v48.32,57.44 | U9.2 11.09,41.38 U9.17 | 60.51,62.69 59.27,62.69 58.98,62.98 58.6,62.98 58.41,62.8 58.41,62.29 U1.47 | IC1.9 47.89,64.55 47.89,65.87
  Top 0.254: 6.51,39.66 C33.2 R18.1 8.46,39.73 8.82,40.09 9.47,40.09 U9.4 | U9.7 11.74,40.73 U9.17 | IC1.4 47.42,62.61 IC1.9 | C11.2 60.12,65.26 C12.2 | C31.2 7.88,45.22 | v4.66,32.04 3.77,32.93 L3.1
  other vias: 53.65,58.1 43.82,61.42 41.71,58.07 39.81,62.29 14.81,38.39 60.74,66.07 54.16,64.75 38.87,25.18 14.79,62.21
  pour Top: 11.54,20.73 35.74,20.73 36.71,21.7 49.54,21.7 50.73,22.89 84.46,22.89 85.1,23.53 85.1,48.6 90.2,53.7 90.2,79.2 88.98,80.42 -2.89,80.42 -3.22,80.09 -3.24,44.41 -3.24,44.38 8.62,44.38 8.62,32.62 -11.8,32.62 0.26,20.56 11.36,20.56
  pour Route2: 4.68,32.59 8.57,32.59 8.57,44.43 -3.27,44.43 -3.27,80.42 90.25,80.42 90.25,47.38 85.12,47.38 85.12,22.77 50.73,22.77 50.73,22.71 49.77,21.75 36.68,21.75 35.69,20.76 2.32,20.76 0.95,22.13 0.95,32.72 4.55,32.72
  pour Bottom: 1.38,20.73 1.38,32.65 8.59,32.65 8.59,44.51 -3.19,44.51 -3.19,80.3 90.25,80.3 90.25,47.35 85.15,47.35 85.15,22.77 50.68,22.77 49.82,21.9 36.94,21.9 35.62,20.58 1.4,20.58 1.35,20.53
GND-ISO  (via drill 0.38)
  other vias: 67.62,19.06 47.94,16.95 42.63,19.77
  pour Top (rank 2): 10.27,1.68 10.27,19.46 11.54,20.73 35.67,20.73 36.71,21.77 42.4,21.77 49.71,21.77 50.83,22.89 84.89,22.89 85.35,22.43 85.35,3.69 80.09,-1.57 13.49,-1.57 10.27,1.66
  pour Route2 (rank 2): 10.27,1.68 10.27,19.46 11.54,20.73 35.67,20.73 36.66,21.72 49.69,21.72 50.73,22.77 84.94,22.77 85.33,22.38 85.33,3.61 80.22,-1.49 8.64,-1.49 8.49,-1.34 8.49,-0.09
  pour Bottom (rank 3): 10.27,1.68 10.27,19.36 11.41,20.5 35.57,20.5 36.94,21.88 49.79,21.88 49.84,21.93 50.5,22.59 50.96,22.59 84.84,22.59 85.27,22.16 85.27,3.41 80.25,-1.62 13.57,-1.62
INT_RTC  (via drill 0.2)
  Top 0.152: U1.40 59.45,59.66 59.95,59.66 60.23,59.93 v60.23,60.21 | U10.3 31.53,63.23 32.21,62.54 37.09,62.54 37.14,62.54 37.84,61.84 37.84,61.01 | v46.41,59.14 38.21,59.14 38.03,59.32 38.03,60.82 37.84,61.01 | 37.84,61.01 37.81,61.03
  Route2 0.152: v46.41,59.14 47.23,59.95 49.35,59.95 49.58,59.72 52.75,59.72 52.92,59.54 52.92,59.35 53.31,58.97 53.85,58.97 54.23,59.35 54.23,60.22 54.57,60.56 56.19,60.56 56.5,60.87 56.5,61.71 56.97,62.19 59.95,62.19 60.23,61.91 v60.23,60.21
INT_SOIL  (via drill 0.2)
  Top 0.152: v51.59,60.84 v51.6,60.83 U1.3 | U8.7 v57.08,27.87
  Top 0.254: R14.1 57.39,23.48 57.08,23.78 U8.7
  Bottom 0.152: v57.08,27.87 57.08,53.05 57.11,53.08 57.11,53.31 57.08,53.34 57.08,53.99 57.6,54.51 57.6,59.33 57.61,59.34 57.39,59.57 54.44,59.57 53.85,58.97 53.31,58.97 52.61,59.67 52.58,59.7 52.51,59.77 52.51,60.64 52.31,60.83 v51.6,60.83
INT_SOIL_ISO  (via drill 0.25, 0.38)
  Top 0.254: U$2.P$7 37.13,9.8 v37.14,9.81 | R17.1 51.9,21.24 v50.86,22.28
  Route2 0.254: v37.14,9.81 38.44,9.81 38.72,10.09 38.72,14.97 39.2,15.45 49.77,15.45 50.1,15.78 50.1,21.52 v50.86,22.28
INT_SOILTEMP  (via drill 0.2)
  Top 0.152: 52.18,60.43 U1.4 52.53,60.41 51.97,60.41 51.83,60.27 51.45,60.27 51.28,60.1 49.88,60.1 49.72,59.94 47.48,59.94 47.24,60.18 45.39,60.18 45.25,60.03 44.67,60.03 44.56,59.93 | v58.38,28 58.38,26.25 U8.6 | 45.14,59.93 44.56,59.93 | 44.56,59.93 44.33,59.93 v44.15,60.1
  Top 0.254: R15.1 59.82,24.9 59.44,24.52 58.45,24.52 58.35,24.62 U8.6
  Bottom 0.152: v58.38,28 57.92,27.54 57.55,27.54 57.31,27.31 56.85,27.31 56.52,27.64 56.52,28.1 56.8,28.39 56.8,53.17 56.83,53.19 55.46,54.56 55.46,56.47 55.81,56.82 55.86,56.82 57.31,58.27 57.31,58.96 56.98,59.29 54.64,59.29 54.04,58.69 53.19,58.69 52.62,59.27 47.05,59.27 46.97,59.19 46.97,58.91 46.65,58.58 46.18,58.58 46.16,58.59 44.32,58.59 | v44.15,60.1 44.15,58.76 44.32,58.59 | 44.33,58.58 44.32,58.59
INT_SOILTEMP_ISO
  Top 0.254: U$3.P$7 69.41,10.18 70.01,10.78 70.01,21.04 69.51,21.54 64.59,21.54 64.34,21.29 R16.1
IRQ_LIGHTNING  (via drill 0.2)
  Top 0.152: v30.72,55.76 30.89,55.58 31.22,55.58 31.45,55.35 31.91,55.35 32.15,55.58 43.17,55.58 43.35,55.4 44.04,55.4 44.22,55.58 47.24,55.58 48.18,56.52 48.18,56.85 48.16,56.87 48.08,56.87 47.76,57.2 47.76,57.67 48.08,58 48.53,58 48.75,58.22 51.13,58.22 51.15,58.2 51.8,58.2 51.96,58.03 U1.10 | U9.10 13.38,40.7 v14.71,40.7
  Route2 0.152: v30.72,55.76 30.72,51.92 30.44,51.65 24.21,51.65 24.01,51.44 | 24.01,41.08 23.63,40.7 v14.71,40.7
  Route2 0.203: 24.01,41.08 24.01,51.44
N$1
  Top 0.152: U1.46 58.82,62.24 60.79,62.24 60.99,62.03 60.99,61.6 61.09,61.5 C10.1 63.11,61.5 R1.2
N$2
  Top 0.152: 58.01,62.29 U1.48 57.99,62.92 58.34,63.26 59.59,63.26 59.82,63.02 60.79,63.02 61.02,63.25 61.02,65.41 61.4,65.79 61.42,65.79 61.63,66 61.63,67.29 61.45,67.47 60.47,67.47 L4.1
N$3
  Top 0.152: 68.36,72.22 R2.1 68.46,72.11 68.46,72.83 68.17,73.12 RESET.3
  Top 0.254: RESET.4 RESET.3
N$4
  Top 0.152: Y1.3 55.46,49.66 C18.1 R8.1
N$7
  Top 0.152: U1.21 55.19,54.3 54.77,53.88 54.19,53.88 53.73,53.42 53.73,51.9 Y1.1
  Top 0.254: C19.1 53.73,51.87 Y1.1
N$8
  Top 0.152: R8.2 56.75,52.28 56.75,53.14 56.5,53.4 56.04,53.4 55.58,53.86 U1.22
N$9
  Top 0.152: R10.2 J2.A5
  Top 0.254: J2.A5
N$10
  Top 0.152: R9.2 55.25,72.75 J2.B5
N$11
  Top 0.203: L2.1 62.21,69.48
  Top 0.254: J2.B4_A9 54.6,73.43 55,73.82 55,74.4 55.43,74.84 59.06,74.84 59.34,74.56 59.34,74.16 59.27,74.08 59.27,73.56 59.42,73.41 59.42,72.77 J2.A4_B9 59.39,72.74 59.39,69.65 59.69,69.35 C21.1 62.09,69.35 L2.1
N$12
  Top 0.152: U3.22
  Top 0.254: R13.1 U3.22
N$13
  Top 0.254: U8.4 59.64,21.27 61.28,21.27 R16.2
N$14
  Top 0.254: R17.2 55.77,21.24 U8.1
N$15
  Top 0.254: U9.1 8,42.03 C31.1
N$16
  Top 0.254: U9.3 7.94,40.73 R18.2 C33.1 4,40.8 3.74,41.05 3.74,43.14 L3.2
N$17
  Top 0.203: R20.2 38.66,21.06 R19.1 | U6.P13 41.66,19.39
  Top 0.254: R19.1 41.38,19.67 41.66,19.39
N$22
  Top 0.152: U11.P$2 67.01,42.76 66.66,43.11 49.64,43.11 49,43.75 49,46.85 U12.P$4
N$23
  Top 0.152: U12.P$2 54.41,33.13 54.06,33.48 37.65,33.48 36.66,34.47 U13.P$4
N$24
  Top 0.152: U13.P$2 41.74,32.32 41.36,32.7 24.31,32.7 23.98,33.03 23.98,41.05 U14.P$4
N$25
  Top 0.152: 41.15,63.09 40.7,62.63 40.7,59.77 40.98,59.49 45.96,59.49 46.36,59.9 47.12,59.9 47.36,59.66 49.83,59.66 49.96,59.78 51.36,59.78 51.57,59.99 51.95,59.99 51.99,60.03 U1.5
  Top 0.254: USR_BUTTON.2 41.15,63.09 USR_BUTTON.1
N$26
  Top 0.152: 25.08,55.2 25.08,55.68 D1.A
  Top 0.203: LS1.N 27.95,50.91 Q2.3 25.08,51.89 25.08,53.75 25.08,55.68 D1.A
  Top 0.254: 28.63,51.66 LS1.N
N$27
  Top 0.203: Q2.1 22.19,51.86 R25.1
N$28
  Top 0.254: U10.8 D2.C 35.96,65.79 C46.1 37.7,67.39 38.82,68.51 38.82,69.86 C43.1
N$29
  Top 0.254: C48.2 26.11,63.84 XTAL1.1 26.37,63.58 26.45,63.49 26.62,63.49 26.7,63.58 26.7,63.94 27.26,64.5 U10.2
N$30
  Top 0.254: XTAL1.2 25.81,66.89 | 25.81,66.89 25.81,67.97 C47.2 | 25.81,66.89 26.37,66.89 26.45,66.97 26.62,66.97 27.83,65.77 U10.1
NEOPIXEL_3.3V
  Top 0.152: U1.27 57.59,54.89 57.86,54.62 57.86,54.2 58.81,53.25 59.73,53.25 59.76,53.22 60.05,52.93 | 59.81,52.93 60.05,52.93 | 60.05,52.93 U15.3
NEOPIXEL_5V
  Top 0.254: U15.4 61.34,49.6 61.93,49 U11.P$4
PDIS
  Top 0.203: Q1.3 37.98,22.59 R23.1
  Top 0.406: R23.1 39.56,22.62 39.78,22.4 40.95,22.4 41.17,22.62 41.34,22.62 41.69,22.97 41.69,24.31 U6.P8
PDIS_EN  (via drill 0.2)
  Top 0.152: v53.35,57.11 53.18,57.11 53.08,57.21 52.58,57.21 U1.12 52.53,57.21 52.02,57.21 51.54,56.73 51.54,56.72 51.28,56.46 51.28,56.05 51.24,56.01 50.45,56.01 50.42,56.04
  Top 0.203: 50.42,56.04 R24.1 | Q1.1 32.58,23.54 32.21,23.91 32.21,25.15 v32.87,25.81
  Route2 0.152: v32.87,25.81 32.87,48.55 33.28,48.95 v52.76,48.95
  Bottom 0.152: v52.76,48.95 54.69,48.95 54.97,49.23 54.97,56.98 54.72,57.23 53.47,57.23 v53.35,57.11
PRB1
  Top 0.152: U$2.P$4 25.49,9.8 25.51,9.81
  Top 0.254: J4.1 29.42,8.95 28.56,9.81 25.51,9.81 24.09,9.81 24.01,9.74
PRB1_GND
  pour Top: 20.43,-0.86 20.43,9.3 21.7,10.57 31.86,10.57 33.13,9.3 33.13,6.76 34.4,5.49 34.4,0.41 33.13,-0.86
  pour Route2: 19.16,0.41 20.43,1.68 20.43,10.57 33.13,10.57 33.13,6.76 34.4,5.49 34.4,4.22 34.4,0.41 33.13,-0.86 20.43,-0.86
  pour Bottom (rank 2): 20.43,0.41 20.43,10.57 33.13,10.57 33.36,10.34 33.36,5.21 33.36,0.06 31.76,-1.54 22.38,-1.54
PROBE2
  Top 0.254: J5.1 58.33,8.92 57.07,10.18 U$3.P$4
PROBE2_GND
  pour Top: 49.26,-0.4 49.26,9.73 50.78,11.26 58.38,11.26 62.62,7.02 62.62,-0.04 61.14,-1.52 50.37,-1.52
  pour Route2: 49.64,0.41 49.64,9.84 50.98,11.18 59.01,11.18 61.68,8.52 62.62,7.58 62.62,-1.19 51.16,-1.19 49.56,0.41 49.61,0.41
  pour Bottom (rank 2): 49.64,-0.86 49.64,10.09 50.65,11.11 59.11,11.11 62.16,8.06 62.16,-0.3 61.42,-1.03 49.84,-1.03 49.69,-0.88 49.66,-0.88
QSPI_CLK  (via drill 0.2)
  Top 0.152: 54.79,63.31 U1.56 54.79,61.66 v55.22,61.22
  Top 0.203: IC1.6 50.62,63.46 51.59,63.46 52.02,63.89 53.62,63.89 54.05,63.46 54.64,63.46 54.79,63.31 | v51.77,66.31 51.24,66.31 51.23,66.3 49.85,66.3 49.5,66.65 49.5,67.15 49.67,67.32 49.93,67.32 U2.6
  Route15 0.203: v51.77,66.31 54.12,66.31 54.79,65.64 54.79,63.58
  Route15 0.254: v55.22,61.22 54.79,61.65 54.79,63.58
SCL  (via drill 0.2)
  Top 0.152: v58.63,60.07 58.63,58.63 58.8,58.46 58.88,58.46 58.9,58.43 U1.37 | U10.6 33.61,63.28 v32.44,63.28 | U9.11 14.43,41.38 | 14.43,41.38 14.76,41.71 14.76,47 15.08,47.31 U7.2 | U6.P2 45.56,25.62 v45.68,25.74 | R12.1 v17.49,33.43 17.49,41.02 17.13,41.38 14.43,41.38
  Top 0.254: R12.1 16.36,31.6 15.93,31.17 | 15.93,31.17 J3.4 | 15.93,31.17 15.93,32.44 U5.4
  Route2 0.152: 58.63,58.48 58.63,58.51 | v58.63,60.07 58.63,58.83 58.63,58.51 | 54.87,51.44 55.2,51.44 55.56,51.8 55.56,55.87 55.46,55.96 55.46,56.53 55.68,56.75 55.76,56.75 56.17,57.16 57.44,57.16 57.97,57.69 57.97,57.85 58.63,58.51 | v32.44,63.28 32.42,63.25 32.42,51.75 32.83,51.34 50.15,51.34 50.26,51.44 54.87,51.44 | 54.87,51.44 55.38,50.93 55.38,47.33 55.02,46.97 54.11,46.97 54.08,47 45.83,47 45.5,46.67 45.5,27.03 45.68,26.85 v45.68,25.74 45.68,22.82 45.35,22.49 25.08,22.49 24.57,22.99 24.57,33.71 24.29,33.99 18.05,33.99 v17.49,33.43
SCL_ISO  (via drill 0.2, 0.38)
  Top 0.152: U6.P19 45.56,18.56 v45.65,18.65
  Top 0.203: R22.1 65.06,12.45 U$3.P$8 62.97,12.48 62.64,12.81 62.64,18.55 | 45.56,18.72 45.9,19.06
  Top 0.254: U$2.P$8 37.01,12.1 37.17,12.25 v37.17,12.3 | U6.P19 45.56,18.72 | 45.9,19.06 46.59,19.06 47.04,18.61 49.6,18.61 50.01,19.02 62.17,19.02 62.64,18.55
  Route2 0.254: v37.17,12.3 37.17,16.21 37.47,16.52 44.96,16.52 45.65,17.2 v45.65,18.65
SD_CLK  (via drill 0.2)
  Top 0.152: U1.18 53.99,55.5 v54.01,56.22 | v20.5,69.83 U$1.P5
  Bottom 0.152: v54.01,56.22 54.01,53.91 53.55,53.45 33.41,53.45 33.33,53.52 27.18,53.52 27.11,53.6 27.11,54.52 26.75,54.87 25.91,54.87 25.58,54.54 25.58,54.31 25.03,53.75 20.5,53.75 19.97,54.29 19.97,64.42 20.96,65.42 20.96,67.27 20.38,67.86 20.38,69.73 v20.5,69.83
SDA  (via drill 0.2)
  Top 0.152: v58.01,60.82 v58.01,60.81 58.01,58.25 58.09,58.18 58.76,58.18 58.9,58.03 U1.36 | U10.5 v33.66,61.32 | J3.3 14.93,32.22 14.61,32.54 14.61,33.26 15.08,33.72 U5.3 16.88,33.72 17.05,33.89 17.05,39.07 v16.92,39.2 | U9.13 v12.39,44.2 12.39,46.25 11.59,47.05 11.59,49.79 12.33,50.53 19.16,50.53 19.54,50.15 19.54,47.58 19.26,47.3 17.86,47.3 U7.3 | U6.P3 44.91,25.72 44.98,25.79 44.98,26.4 v45.06,26.49
  Top 0.254: R11.1 15.25,28.46 14.92,28.79 14.92,29.91 J3.3
  Route2 0.152: v58.01,60.82 58.01,58.66 57.44,58.09 57.44,57.72 57.16,57.44 55.98,57.44 55.18,56.65 55.18,55.85 55.28,55.75 55.28,52.08 54.92,51.72 51.57,51.72 50.52,52.78 49.98,52.78 49.05,51.85 33.31,51.85 32.85,52.31 32.85,61.02 33.15,61.32 v33.66,61.32 33.11,61.88 33.11,63.46 33.06,63.46 32.68,63.84 32.21,63.84 31.88,63.51 31.88,63.05 31.99,62.94 31.99,56.19 31.96,56.16 31.96,51.72 32.05,51.72 32.71,51.06 50.27,51.06 50.37,51.16 54.64,51.16 55.02,50.78 55.02,47.63 54.67,47.28 45.71,47.28 44.97,46.54 44.97,26.6 44.97,26.58 | v12.39,44.2 12.38,44.19 12.38,39.38 12.55,39.2 v16.92,39.2 16.95,39.22 24.72,39.22 25.05,38.89 25.05,23.63 25.66,23.02 44.38,23.02 44.97,23.61 44.97,26.58 | v45.06,26.49 44.97,26.58
SDA_ISO  (via drill 0.2, 0.38)
  Top 0.203: U$3.P$1 50.78,17.08 | 50.78,17.08 R21.1 | U6.P18 44.91,15.53 45.17,15.27 48.52,15.27 48.88,15.63 48.88,16.77 49.18,17.08 50.78,17.08
  Top 0.254: U$2.P$1 v21.32,16.7 v21.32,16.69 | U6.P18 44.91,18.27 44.9,18.28 44.9,19.07 v44.69,19.28
  Route2 0.254: v21.32,16.69 35.16,16.69 35.8,17.33 39.1,17.33 39.22,17.33 42.96,17.33 43.47,17.84 43.47,19.06 43.69,19.28 v44.69,19.28
SIO0  (via drill 0.2)
  Top 0.152: U1.57 54.39,63.02 54.26,63.15 53.92,63.15 53.62,63.46 52.2,63.46 v51.36,62.61 IC1.5 | v50.98,66.89 50.01,66.89 U2.5
  Top 0.203: 50.59,62.59 IC1.5
  Bottom 0.152: 50.58,65.18 50.58,64.01 51.42,63.17 51.42,62.67 v51.36,62.61 | 50.55,65.21 50.55,66.45 v50.98,66.89
  Bottom 0.203: 50.58,65.18 50.55,65.21
SIO1  (via drill 0.2)
  Top 0.152: U1.59 53.59,63.01 53.45,63.15 52.33,63.15 51.92,62.74 51.92,62.38 51.59,62.05 51.23,62.05 51.11,61.93 45.83,61.93 | 45.83,61.93 44.63,61.93 44.43,62.14 44.43,63.46 45.03,64.06 45.56,64.06 45.66,63.96 45.93,63.96 46.18,64.21 IC1.2 | 45.83,61.93 v45.83,62.2 | U2.2 46.67,67.9 v46.46,67.69
  Bottom 0.152: v45.83,62.2 45.83,63.02 45.95,63.14 45.95,67.76 46.08,67.9 46.25,67.9 v46.46,67.69
SIO2  (via drill 0.2)
  Top 0.152: v44.38,68.03 44.86,67.55 45.6,67.55 46.11,67.04 46.73,67.04 47.09,67.4 U2.3 | U1.58 54.01,62.25 54.01,61.74 54.19,61.57 v54.19,61.45
  Top 0.203: v45.3,63.41 IC1.3
  Bottom 0.152: v45.3,63.41 45.3,67.11 v44.38,68.03 | v54.19,61.45 54.11,61.53 50.48,61.53
  Bottom 0.203: 50.48,61.53 50.22,61.27 45.51,61.27 45.43,61.35 45.32,61.35 45.02,61.65 45.02,63.13 v45.3,63.41
SIO3  (via drill 0.2)
  Top 0.152: U1.55 55.19,63.57 | v52.05,67.39 51.73,67.71 50.83,67.71 50.64,67.9 U2.7
  Top 0.203: IC1.7 v51.52,64.22 53.75,64.22 54.19,63.79 54.78,63.79 54.8,63.76 55,63.76 55.19,63.57
  Bottom 0.152: v51.52,64.22 51.9,64.22 52.33,64.65 52.33,67.11 v52.05,67.39
SWCLK  (via drill 0.25, 0.38)
  Top 0.152: U1.24 56.39,54.58 v56.61,54.35
  Top 0.254: J1.1 72.91,47.74 v72.65,47.48
  Route2 0.254: v72.65,47.48 56.55,47.48 56.37,47.66 56.37,54.11 v56.61,54.35
SWDIO  (via drill 0.25, 0.38)
  Top 0.152: 56.81,55.37 U1.25 56.79,56.35 v57.01,56.57
  Top 0.254: J1.3 70.91,48.56 v70.57,48.22
  Route2 0.152: 57.06,48.34 57.06,53.87 57.26,54.08 57.26,54.62 56.78,55.11 56.78,56.17 57.01,56.4 v57.01,56.57
  Route2 0.254: v70.57,48.22 65.41,48.22 65.17,47.97 64.59,47.97 64.5,48.06 57.33,48.06 57.06,48.34
SWITCH  (via drill 0.2)
  Top 0.152: U1.13 52.53,56.81 52.18,56.81 52.02,56.81 51.84,56.62 51.56,56.34 51.56,55.67 50.91,55.02 44.26,55.02 44.16,55.13 44.16,55.12 43.23,55.12 43.23,55.13 32.08,55.13 32.03,55.07 27.59,55.07 27.21,55.46 27.21,56.8 26.37,57.64 17.43,57.64 16.49,58.58 16.49,63.47 v16.77,63.76 | 16.92,70.6 U$1.G1 v19.64,69.32 19.66,69.32
  Route2 0.152: v16.77,63.76 19.64,66.62 v19.64,69.32
USB_N
  Top 0.152: J2.A7 56.75,72.78 56.73,72.8
  Top 0.254: R4.1 56.73,68.58 56.48,68.82 56.48,71.76 56.61,71.89 | 56.78,72.73 J2.A7 | 57.73,72.44 57.75,72.46 J2.B7 57.73,72.73 57.73,72.05 57.54,71.86 56.65,71.86 56.61,71.89 | 56.61,71.89 56.61,71.93 56.73,72.05 56.73,72.8 56.73,72.83
USB_P
  Top 0.203: 56.25,72.8 J2.B6 56.25,72.81 56.28,72.83
  Top 0.254: R3.1 55.86,68.58 56.1,68.82 56.1,71.92 56.23,72.05 56.23,72.41 56.28,72.45 56.28,72.83 | 56.25,72.8 56.25,73.91 56.42,74.07 57.11,74.07 57.26,73.92 J2.A6
USBD_N
  Top 0.152: R4.2 56.98,67.19 56.73,66.94 56.73,65.34 56.73,65.18 56.73,63.07 56.79,63.01 U1.51
USBD_P
  Top 0.152: 55.61,67.22 R3.2 55.58,66.86 56.45,65.99 56.45,65.34 56.45,65.18 56.45,63.07 56.39,63.01 U1.52
V_USB  (via drill 0.38)
  Top 0.203: USB.TP 69.55,68.13 | 65.78,66.17 U4.1 65.74,66.05 65.74,65.18 65.46,64.9 v64.88,64.9 64.17,64.9 63.8,65.27 U4.3 | C34.2 C35.2 38.61,26.33 38.23,26.7 v38.23,27.54
  Top 0.254: L2.2 C22.1 65.26,68.1 65.7,67.66 65.7,67.37 | 65.7,67.37 U4.1 67.19,66.09 C23.2 | USB.TP 66.11,67.77 65.7,67.37
  Top 0.406: v61.93,31.48 U11.P$1 61.86,29.11 61.86,27.08 62.14,26.8 C50.1 | U12.P$1 49.61,28.91 C49.1 50.63,26.8 v50.91,27.08 | v38.23,27.54 38.23,28.51 37.56,29.18 U13.P$1 36.68,29.16 C51.1 36.68,26.07 38.01,24.75 R23.2 39.15,23.78 40,22.93 40.73,22.93 40.97,23.17 40.97,24.29 U6.P9 | C52.1 23.96,29.16 U14.P$1 25.21,29.18 v25.74,28.66 | U15.6 63.33,50.32 C45.1 64.83,48.72 v64.88,48.67
  Route15 0.406: v61.93,31.48 61.93,33.43 | 61.93,33.43 61.93,49.41 | 61.93,33.43 60.66,32.16 52.18,32.16 50.91,30.89 v50.91,27.08 45.44,27.08 45.35,27.17 44.78,27.17 44.69,27.08 38.69,27.08 v38.23,27.54 37.7,27.01 25.97,27.01 25.74,27.24 v25.74,28.66 | v64.88,48.67 62.67,48.67 61.93,49.41 | v64.88,64.9 62.21,62.24 62.21,56.34 61.93,56.06 61.93,55.24 62.31,54.86 62.31,54.52 61.93,54.14 61.93,49.41
VCC-ISO  (via drill 0.2, 0.38)
  Top 0.203: U6.P12 41.01,18.51 | 47.89,20.58 47.8,20.75 C38.1 | R21.2 51.69,18.21 v51.8,18.32 | U$3.P$3 50.9,12.48 C41.2 50.9,13.55 v50.88,13.57 | R22.2 68.68,13.41 v68.76,13.49 | 44.02,19 44.06,18.96 44.26,18.75 U6.P17 | 41.01,18.51 40.94,18.44 40.04,18.44 39.85,18.24 C39.1 | 41.01,18.51 v40.7,18.83 | C40.2 v21.16,13.16 v21.17,13.16
  Top 0.254: U$2.P$3 23.39,12.05 C40.2 | 44.06,18.96 44.06,20.46 v44.41,20.81 47.61,20.81 | 47.61,20.81 47.74,20.81 47.8,20.75 | C37.1 47.79,20.63 47.61,20.81 | R19.2 36.53,19.67 v36.48,19.72
  Route15 0.203: v51.8,18.32 51.85,18.37 51.85,18.93 51.8,18.93 | v68.76,13.49 69.04,13.77 69.73,13.77
  pour Route15 (rank 2): 10.27,6.76 10.27,19.46 11.54,20.73 35.97,20.73 36.81,21.57 49.66,21.57 50.78,22.69 85.05,22.69 85.33,22.41 85.33,11.64 84.94,11.26 19.13,11.26 14.71,6.84 10.34,6.84

## Text on the board
tPlace: K | A | K | K
tNames: Super | Capacitor | MicroSD card | RTC | Blue Daisy | STEAM | Platform | RP2350A | Temp/Humidity | Wi-Fi/BLE | Lightning sensor | BME690 | Qwiic | I2C Isolator | Soil pH Sensor | Soil Temp Sensor
bNames: Blue Daisy STEAM platform